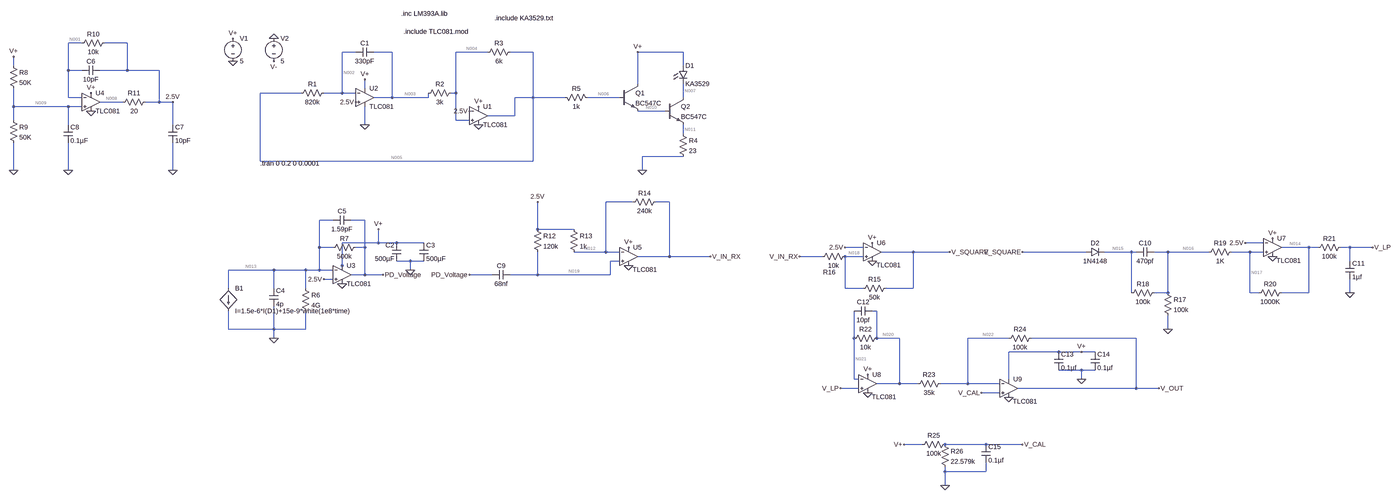
[diagram p0: schematic final.asc, whole sheet]
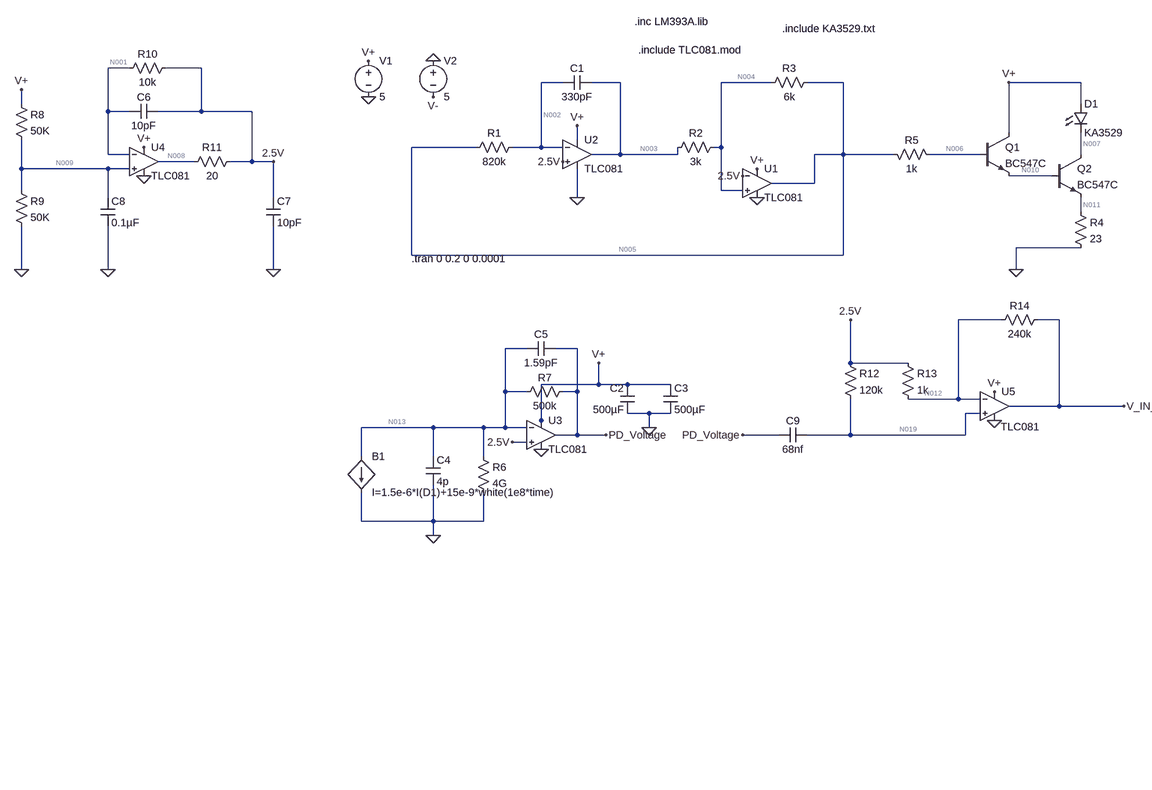
[diagram p1: schematic final.asc, part, row 1 of 1, column 1 of 2]
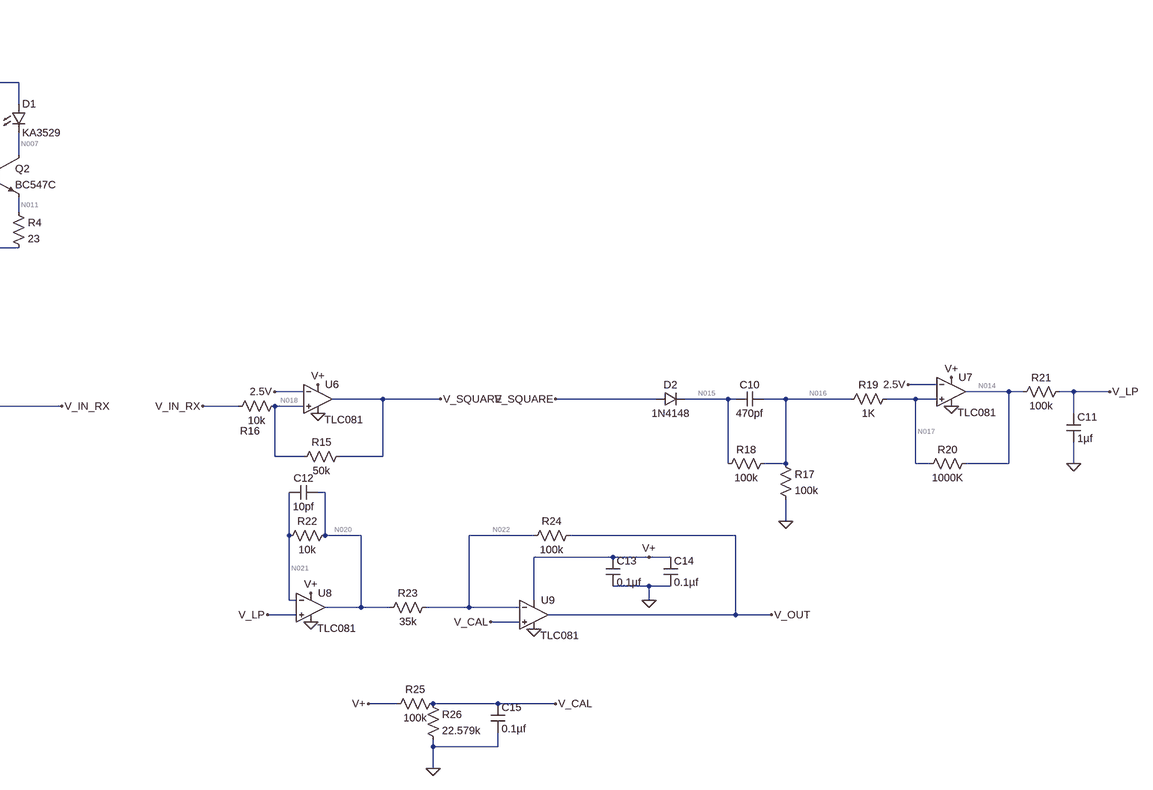
[diagram p2: schematic final.asc, part, row 1 of 1, column 2 of 2]
final.asc, the LTspice schematic file:
Version 4
SHEET 1 3852 1700
WIRE -1088 32 -1136 32
WIRE -928 32 -1008 32
WIRE 192 64 144 64
WIRE 320 64 256 64
WIRE 656 64 544 64
WIRE 816 64 736 64
WIRE 1344 64 1184 64
WIRE -1328 112 -1328 80
WIRE 1344 112 1344 64
WIRE -1136 128 -1136 32
WIRE -1088 128 -1136 128
WIRE -928 128 -928 32
WIRE -928 128 -1024 128
WIRE -816 128 -928 128
WIRE 1184 176 1184 64
WIRE 224 192 224 160
WIRE 0 208 -144 208
WIRE 144 208 144 64
WIRE 144 208 80 208
WIRE 192 208 144 208
WIRE 544 208 544 64
WIRE 544 208 528 208
WIRE -1136 224 -1136 128
WIRE -1088 224 -1136 224
WIRE 320 224 320 64
WIRE 320 224 256 224
WIRE 448 224 448 208
WIRE 448 224 320 224
WIRE 816 224 816 64
WIRE 816 224 752 224
WIRE 928 224 816 224
WIRE 1120 224 1008 224
WIRE 1344 224 1344 176
WIRE -944 240 -1024 240
WIRE -816 240 -816 128
WIRE -816 240 -864 240
WIRE -768 240 -816 240
WIRE -1328 256 -1328 192
WIRE -1136 256 -1328 256
WIRE -1088 256 -1136 256
WIRE 1280 272 1184 272
WIRE 752 288 752 224
WIRE 752 288 656 288
WIRE -1328 304 -1328 256
WIRE 544 304 544 208
WIRE 592 304 544 304
WIRE -1136 320 -1136 256
WIRE -768 320 -768 240
WIRE 224 320 224 256
WIRE 1344 352 1344 320
WIRE 1344 432 1200 432
WIRE -144 448 -144 208
WIRE 816 448 816 224
WIRE 816 448 -144 448
WIRE -1328 480 -1328 384
WIRE -1136 480 -1136 384
WIRE -768 480 -768 384
WIRE 1200 480 1200 432
WIRE 1168 592 1072 592
WIRE 1296 592 1248 592
WIRE 112 656 64 656
WIRE 224 656 176 656
WIRE 832 688 832 592
WIRE 960 688 832 688
WIRE 272 736 272 688
WIRE 272 736 144 736
WIRE 336 736 272 736
WIRE 432 736 336 736
WIRE 3392 736 3328 736
WIRE 64 752 64 656
WIRE 112 752 64 752
WIRE 224 752 224 656
WIRE 224 752 192 752
WIRE 1984 752 1920 752
WIRE 3552 752 3456 752
WIRE 3584 752 3552 752
WIRE 3696 752 3664 752
WIRE 3776 752 3696 752
WIRE 1072 768 1072 592
WIRE 1072 768 960 768
WIRE 1120 768 1072 768
WIRE 2160 768 2048 768
WIRE 2288 768 2160 768
WIRE 2768 768 2544 768
WIRE 2928 768 2832 768
WIRE 2944 768 2928 768
WIRE 3056 768 3008 768
WIRE 3200 768 3056 768
WIRE 3344 768 3280 768
WIRE 3392 768 3344 768
WIRE 1296 784 1296 592
WIRE 1296 784 1184 784
WIRE 1440 784 1296 784
WIRE 1840 784 1760 784
WIRE 1984 784 1920 784
WIRE 384 800 336 800
WIRE 432 800 384 800
WIRE 1120 800 1088 800
WIRE 3696 800 3696 752
WIRE 144 816 144 736
WIRE -96 832 -256 832
WIRE 16 832 -96 832
WIRE 64 832 64 752
WIRE 64 832 16 832
WIRE 112 832 64 832
WIRE 144 832 144 816
WIRE 384 832 384 800
WIRE 224 848 224 752
WIRE 224 848 176 848
WIRE 288 848 224 848
WIRE 672 848 592 848
WIRE 832 848 832 768
WIRE 832 848 736 848
WIRE 1088 848 1088 800
WIRE 1088 848 832 848
WIRE 112 864 80 864
WIRE -256 896 -256 832
WIRE -96 896 -96 832
WIRE 16 896 16 832
WIRE 1920 896 1920 784
WIRE 1984 896 1920 896
WIRE 2160 896 2160 768
WIRE 2160 896 2064 896
WIRE 2928 912 2928 768
WIRE 3056 912 3056 768
WIRE 3056 912 3008 912
WIRE 3344 912 3344 768
WIRE 3376 912 3344 912
WIRE 3552 912 3552 752
WIRE 3552 912 3456 912
WIRE 3696 912 3696 864
WIRE 2032 976 2016 976
WIRE -256 1040 -256 976
WIRE -96 1040 -96 960
WIRE -96 1040 -256 1040
WIRE 16 1040 16 976
WIRE 16 1040 -96 1040
WIRE 3056 1040 3056 992
WIRE -96 1072 -96 1040
WIRE 1952 1072 1952 976
WIRE 2032 1072 2032 976
WIRE 2112 1072 2032 1072
WIRE 2496 1072 2352 1072
WIRE 2944 1072 2576 1072
WIRE 2672 1120 2496 1120
WIRE 2752 1120 2672 1120
WIRE 2800 1120 2752 1120
WIRE 2752 1184 2672 1184
WIRE 2800 1184 2752 1184
WIRE 1952 1216 1952 1072
WIRE 1968 1216 1952 1216
WIRE 2496 1216 2496 1120
WIRE 2752 1216 2752 1184
WIRE 2112 1232 2112 1072
WIRE 2112 1232 2032 1232
WIRE 2176 1232 2112 1232
WIRE 2352 1232 2352 1072
WIRE 2352 1232 2256 1232
WIRE 2464 1232 2352 1232
WIRE 1968 1248 1904 1248
WIRE 2944 1248 2944 1072
WIRE 2944 1248 2528 1248
WIRE 3024 1248 2944 1248
WIRE 2464 1264 2400 1264
WIRE 2192 1536 2128 1536
WIRE 2416 1536 2272 1536
WIRE 2544 1536 2416 1536
WIRE 2272 1632 2272 1616
WIRE 2416 1632 2416 1600
WIRE 2416 1632 2272 1632
WIRE 2272 1680 2272 1632
FLAG -96 16 0
FLAG -240 96 0
FLAG -96 96 V-
FLAG -240 16 V+
FLAG 224 160 V+
FLAG 624 256 V+
FLAG 192 240 2.5V
FLAG 592 272 2.5V
FLAG 224 320 0
FLAG 624 320 0
FLAG 1200 480 0
FLAG 1184 64 V+
FLAG 80 864 2.5V
FLAG 384 832 0
FLAG 144 880 0
FLAG 272 688 V+
FLAG -96 1072 0
FLAG -1136 480 0
FLAG -1328 480 0
FLAG -768 480 0
FLAG -1328 80 V+
FLAG 1152 816 0
FLAG 288 848 PD_Voltage
FLAG 592 848 PD_Voltage
FLAG -768 240 2.5V
FLAG 832 592 2.5V
FLAG 1152 752 V+
FLAG 1440 784 V_IN_RX
FLAG -1056 272 0
FLAG -1056 208 V+
FLAG 1760 784 V_IN_RX
FLAG 1920 752 2.5V
FLAG 2016 736 V+
FLAG 2016 800 0
FLAG 2288 768 V_SQUARE
FLAG 2544 768 V_SQUARE
FLAG 3056 1040 0
FLAG 3424 720 V+
FLAG 3424 784 0
FLAG 3328 736 2.5V
FLAG 3696 912 0
FLAG 3776 752 V_LP
FLAG 2000 1200 V+
FLAG 2000 1264 0
FLAG 2752 1120 V+
FLAG 2496 1280 0
FLAG 2752 1216 0
FLAG 1904 1248 V_LP
FLAG 2128 1536 V+
FLAG 2272 1680 0
FLAG 2544 1536 V_CAL
FLAG 2400 1264 V_CAL
FLAG 3024 1248 V_OUT
DATAFLAG 832 224 ""
SYMBOL res 96 192 R90
WINDOW 0 0 56 VBottom 2
WINDOW 3 32 56 VTop 2
SYMATTR InstName R1
SYMATTR Value 820k
SYMBOL res 544 192 R90
WINDOW 0 0 56 VBottom 2
WINDOW 3 32 56 VTop 2
SYMATTR InstName R2
SYMATTR Value 3k
SYMBOL res 752 48 R90
WINDOW 0 0 56 VBottom 2
WINDOW 3 32 56 VTop 2
SYMATTR InstName R3
SYMATTR Value 6k
SYMBOL cap 256 48 R90
WINDOW 0 0 32 VBottom 2
WINDOW 3 32 32 VTop 2
SYMATTR InstName C1
SYMATTR Value 330pF
SYMBOL voltage -240 0 R0
WINDOW 123 0 0 Left 0
WINDOW 39 0 0 Left 0
SYMATTR InstName V1
SYMATTR Value 5
SYMBOL voltage -96 0 R0
WINDOW 123 0 0 Left 0
WINDOW 39 0 0 Left 0
SYMATTR InstName V2
SYMATTR Value 5
SYMBOL OpAmps\\opamp2 624 224 R0
SYMATTR InstName U1
SYMATTR Value TLC081
SYMBOL OpAmps\\opamp2 224 160 R0
SYMATTR InstName U2
SYMATTR Value TLC081
SYMBOL npn 1120 176 R0
SYMATTR InstName Q1
SYMATTR Value BC547C
SYMBOL res 1328 336 R0
SYMATTR InstName R4
SYMATTR Value 23
SYMBOL LED 1328 112 R0
SYMATTR InstName D1
SYMATTR Value KA3529
SYMBOL npn 1280 224 R0
SYMATTR InstName Q2
SYMATTR Value BC547C
SYMBOL res 912 208 M90
WINDOW 0 0 56 VBottom 2
WINDOW 3 32 56 VTop 2
SYMATTR InstName R5
SYMATTR Value 1k
SYMBOL OpAmps\\opamp2 144 784 R0
SYMATTR InstName U3
SYMATTR Value TLC081
SYMBOL cap 352 800 R180
WINDOW 0 24 56 Left 2
WINDOW 3 24 8 Left 2
SYMATTR InstName C2
SYMATTR Value 500µF
SYMBOL cap -112 896 R0
SYMATTR InstName C4
SYMATTR Value 4p
SYMBOL res 0 880 R0
SYMATTR InstName R6
SYMATTR Value 4G
SYMBOL cap 176 640 R90
WINDOW 0 0 32 VBottom 2
WINDOW 3 32 32 VTop 2
SYMATTR InstName C5
SYMATTR Value 1.59pF
SYMBOL res 208 736 R90
WINDOW 0 0 56 VBottom 2
WINDOW 3 32 56 VTop 2
SYMATTR InstName R7
SYMATTR Value 500k
SYMBOL bi -256 896 R0
SYMATTR InstName B1
SYMATTR Value I=1.5e-6*I(D1)+15e-9*white(1e8*time)
SYMBOL cap 416 736 R0
SYMATTR InstName C3
SYMATTR Value 500µF
SYMBOL res -1344 96 R0
SYMATTR InstName R8
SYMATTR Value 50K
SYMBOL res -1344 288 R0
SYMATTR InstName R9
SYMATTR Value 50K
SYMBOL res -992 16 R90
WINDOW 0 0 56 VBottom 2
WINDOW 3 32 56 VTop 2
SYMATTR InstName R10
SYMATTR Value 10k
SYMBOL cap -1024 112 R90
WINDOW 0 0 32 VBottom 2
WINDOW 3 32 32 VTop 2
SYMATTR InstName C6
SYMATTR Value 10pF
SYMBOL OpAmps\\opamp2 -1056 176 R0
SYMATTR InstName U4
SYMATTR Value TLC081
SYMBOL res -848 224 R90
WINDOW 0 0 56 VBottom 2
WINDOW 3 32 56 VTop 2
SYMATTR InstName R11
SYMATTR Value 20
SYMBOL cap -784 320 R0
SYMATTR InstName C7
SYMATTR Value 10pF
SYMBOL cap -1152 320 R0
SYMATTR InstName C8
SYMATTR Value 0.1µF
SYMBOL cap 736 832 R90
WINDOW 0 0 32 VBottom 2
WINDOW 3 32 32 VTop 2
SYMATTR InstName C9
SYMATTR Value 68nf
SYMBOL res 816 672 R0
SYMATTR InstName R12
SYMATTR Value 120k
SYMBOL res 944 672 R0
SYMATTR InstName R13
SYMATTR Value 1k
SYMBOL res 1264 576 R90
WINDOW 0 0 56 VBottom 2
WINDOW 3 32 56 VTop 2
SYMATTR InstName R14
SYMATTR Value 240k
SYMBOL OpAmps\\opamp2 1152 720 R0
WINDOW 3 14 110 Left 2
SYMATTR Value TLC081
SYMATTR InstName U5
SYMBOL OpAmps\\opamp2 2016 704 R0
WINDOW 3 14 110 Left 2
SYMATTR Value TLC081
SYMATTR InstName U6
SYMBOL res 2080 880 R90
WINDOW 0 0 56 VBottom 2
WINDOW 3 32 56 VTop 2
SYMATTR InstName R15
SYMATTR Value 50k
SYMBOL res 1936 768 R90
WINDOW 0 87 71 VBottom 2
WINDOW 3 32 56 VTop 2
SYMATTR InstName R16
SYMATTR Value 10k
SYMBOL diode 2768 784 R270
WINDOW 0 32 32 VTop 2
WINDOW 3 0 32 VBottom 2
SYMATTR InstName D2
SYMATTR Value 1N4148
SYMBOL cap 3008 752 R90
WINDOW 0 0 32 VBottom 2
WINDOW 3 32 32 VTop 2
SYMATTR InstName C10
SYMATTR Value 470pf
SYMBOL res 3040 896 R0
SYMATTR InstName R17
SYMATTR Value 100k
SYMBOL res 3024 896 R90
WINDOW 0 0 56 VBottom 2
WINDOW 3 32 56 VTop 2
SYMATTR InstName R18
SYMATTR Value 100k
SYMBOL res 3296 752 R90
WINDOW 0 0 56 VBottom 2
WINDOW 3 32 56 VTop 2
SYMATTR InstName R19
SYMATTR Value 1K
SYMBOL OpAmps\\opamp2 3424 688 R0
WINDOW 3 14 110 Left 2
SYMATTR Value TLC081
SYMATTR InstName U7
SYMBOL res 3472 896 R90
WINDOW 0 0 56 VBottom 2
WINDOW 3 32 56 VTop 2
SYMATTR InstName R20
SYMATTR Value 1000K
SYMBOL res 3680 736 R90
WINDOW 0 0 56 VBottom 2
WINDOW 3 32 56 VTop 2
SYMATTR InstName R21
SYMATTR Value 100k
SYMBOL cap 3680 800 R0
SYMATTR InstName C11
SYMATTR Value 1µf
SYMBOL OpAmps\\opamp2 2000 1168 R0
WINDOW 3 14 110 Left 2
SYMATTR Value TLC081
SYMATTR InstName U8
SYMBOL res 2048 1056 R90
WINDOW 0 0 56 VBottom 2
WINDOW 3 32 56 VTop 2
SYMATTR InstName R22
SYMATTR Value 10k
SYMBOL cap 2016 960 R90
WINDOW 0 0 32 VBottom 2
WINDOW 3 32 32 VTop 2
SYMATTR InstName C12
SYMATTR Value 10pf
SYMBOL res 2272 1216 R90
WINDOW 0 0 56 VBottom 2
WINDOW 3 32 56 VTop 2
SYMATTR InstName R23
SYMATTR Value 35k
SYMBOL res 2592 1056 R90
WINDOW 0 0 56 VBottom 2
WINDOW 3 32 56 VTop 2
SYMATTR InstName R24
SYMATTR Value 100k
SYMBOL cap 2656 1120 R0
SYMATTR InstName C13
SYMATTR Value 0.1µf
SYMBOL cap 2784 1120 R0
SYMATTR InstName C14
SYMATTR Value 0.1µf
SYMBOL OpAmps\\opamp2 2496 1184 R0
WINDOW 3 14 110 Left 2
SYMATTR Value TLC081
SYMATTR InstName U9
SYMBOL res 2288 1520 R90
WINDOW 0 0 56 VBottom 2
WINDOW 3 32 56 VTop 2
SYMATTR InstName R25
SYMATTR Value 100k
SYMBOL res 2256 1520 R0
SYMATTR InstName R26
SYMATTR Value 22.579k
SYMBOL cap 2400 1536 R0
SYMATTR InstName C15
SYMATTR Value 0.1µf
TEXT -144 456 Left 2 !.tran 0 0.2 0 0.0001
TEXT 352 -72 Left 2 !.inc LM393A.lib
TEXT 360 -8 Left 2 !.include TLC081.mod
TEXT 680 -56 Left 2 !.include KA3529.txt

The netlist it stands for:
* final.asc
R1 N002 N005 820k
R2 N004 N003 3k
R3 N005 N004 6k
C1 N003 N002 330pF
V1 V+ 0 5
V2 0 V- 5
XU1 N004 2.5V V+ 0 N005 TLC081  ; pins In+ In- V+ V- OUT
XU2 2.5V N002 V+ 0 N003 TLC081  ; pins In+ In- V+ V- OUT
Q1 V+ N006 N010 0 BC547C
R4 N011 0 23
D1 V+ N007 KA3529
Q2 N007 N010 N011 0 BC547C
R5 N005 N006 1k
XU3 2.5V N013 V+ 0 PD_Voltage TLC081  ; pins In+ In- V+ V- OUT
C2 0 V+ 500µF
C4 N013 0 4p
R6 N013 0 4G
C5 PD_Voltage N013 1.59pF
R7 PD_Voltage N013 500k
B1 N013 0 I=1.5e-6*I(D1)+15e-9*white(1e8*time)
C3 V+ 0 500µF
R8 V+ N009 50K
R9 N009 0 50K
R10 2.5V N001 10k
C6 2.5V N001 10pF
XU4 N009 N001 V+ 0 N008 TLC081  ; pins In+ In- V+ V- OUT
R11 2.5V N008 20
C7 2.5V 0 10pF
C8 N009 0 0.1µF
C9 N019 PD_Voltage 68nf
R12 2.5V N019 120k
R13 2.5V N012 1k
R14 V_IN_RX N012 240k
XU5 N019 N012 V+ 0 V_IN_RX TLC081  ; pins In+ In- V+ V- OUT
XU6 N018 2.5V V+ 0 V_SQUARE TLC081  ; pins In+ In- V+ V- OUT
R15 V_SQUARE N018 50k
R16 N018 V_IN_RX 10k
D2 V_SQUARE N015 1N4148
C10 N016 N015 470pf
R17 N016 0 100k
R18 N016 N015 100k
R19 N017 N016 1K
XU7 N017 2.5V V+ 0 N014 TLC081  ; pins In+ In- V+ V- OUT
R20 N014 N017 1000K
R21 V_LP N014 100k
C11 V_LP 0 1µf
XU8 V_LP N021 V+ 0 N020 TLC081  ; pins In+ In- V+ V- OUT
R22 N020 N021 10k
C12 N020 N021 10pf
R23 N022 N020 35k
R24 V_OUT N022 100k
C13 V+ 0 0.1µf
C14 V+ 0 0.1µf
XU9 V_CAL N022 V+ 0 V_OUT TLC081  ; pins In+ In- V+ V- OUT
R25 V_CAL V+ 100k
R26 V_CAL 0 22.579k
C15 V_CAL 0 0.1µf
.model D D
.lib standard.dio
.model NPN NPN
.model PNP PNP
.lib standard.bjt
.tran 0 0.2 0 0.0001
.inc LM393A.lib
.include TLC081.mod
.include KA3529.txt
.backanno
.end

* Results of the author's LTspice run, read from the files saved beside the schematic
* Operating Point, zero values left out:
*   V(n002) = 2.501 V
*   V(n005) = 2.501 V
*   V(n004) = 2.5 V
*   V(n003) = 2.499 V
*   V(v+) = 5 V
*   V(v-) = -5 V
*   V(2.5v) = 2.501 V
*   V(n006) = 2.501 V
*   V(n010) = 1.93 V
*   V(n011) = 1.185 V
*   V(n007) = 2.853 V
*   V(pd_voltage) = 2.54 V
*   V(n013) = 2.501 V
*   V(n009) = 2.5 V
*   V(n001) = 2.501 V
*   V(n008) = 2.501 V
*   V(n019) = 2.501 V
*   V(n012) = 2.501 V
*   V(v_in_rx) = 2.659 V
*   V(v_square) = -316.1 µV
*   V(n018) = 2.215 V
*   V(n015) = 429.2 µV
*   V(n016) = 433.3 µV
*   V(n017) = 437.7 µV
*   V(n014) = -321.4 µV
*   V(v_lp) = -320.6 µV
*   V(n020) = 155 mV
*   V(n021) = 155 mV
*   V(n022) = 932.6 mV
*   V(v_out) = 3.154 V
*   V(v_cal) = 921 mV
*   I(B1) = 77.03 nA
*   Ic(Q2) = 51.35 mA
*   Ib(Q2) = 151.2 µA
*   Ie(Q2) = -51.5 mA
*   Ic(Q1) = 150.9 µA
*   Ib(Q1) = 317.9 nA
*   Ie(Q1) = -151.2 µA
*   I(D2) = -41.11 pA
*   I(D1) = 51.35 mA
*   I(R26) = 40.79 µA
*   I(R25) = -40.79 µA
*   I(R24) = 22.22 µA
*   I(R23) = 22.22 µA
*   I(R21) = 8.246 pA
*   I(R20) = -759.1 pA
*   I(R19) = 4.374 nA
*   I(R18) = 41.11 pA
*   I(R17) = 4.333 nA
*   I(R16) = -44.31 µA
*   I(R15) = -44.31 µA
*   I(R14) = 655.2 nA
*   I(R13) = -655.2 nA
*   I(R12) = 3.132 pA
*   I(R11) = 655.2 nA
*   I(R10) = 3.133 pA
*   I(R9) = 50 µA
*   I(R8) = 50 µA
*   I(R7) = 77.65 nA
*   I(R6) = 625.3 pA
*   I(R5) = 317.9 nA
*   I(R4) = 51.5 mA
*   I(R3) = 219.4 nA
*   I(R2) = 219.4 nA
*   I(R1) = -3.134 pA
*   I(V1) = -60.19 mA